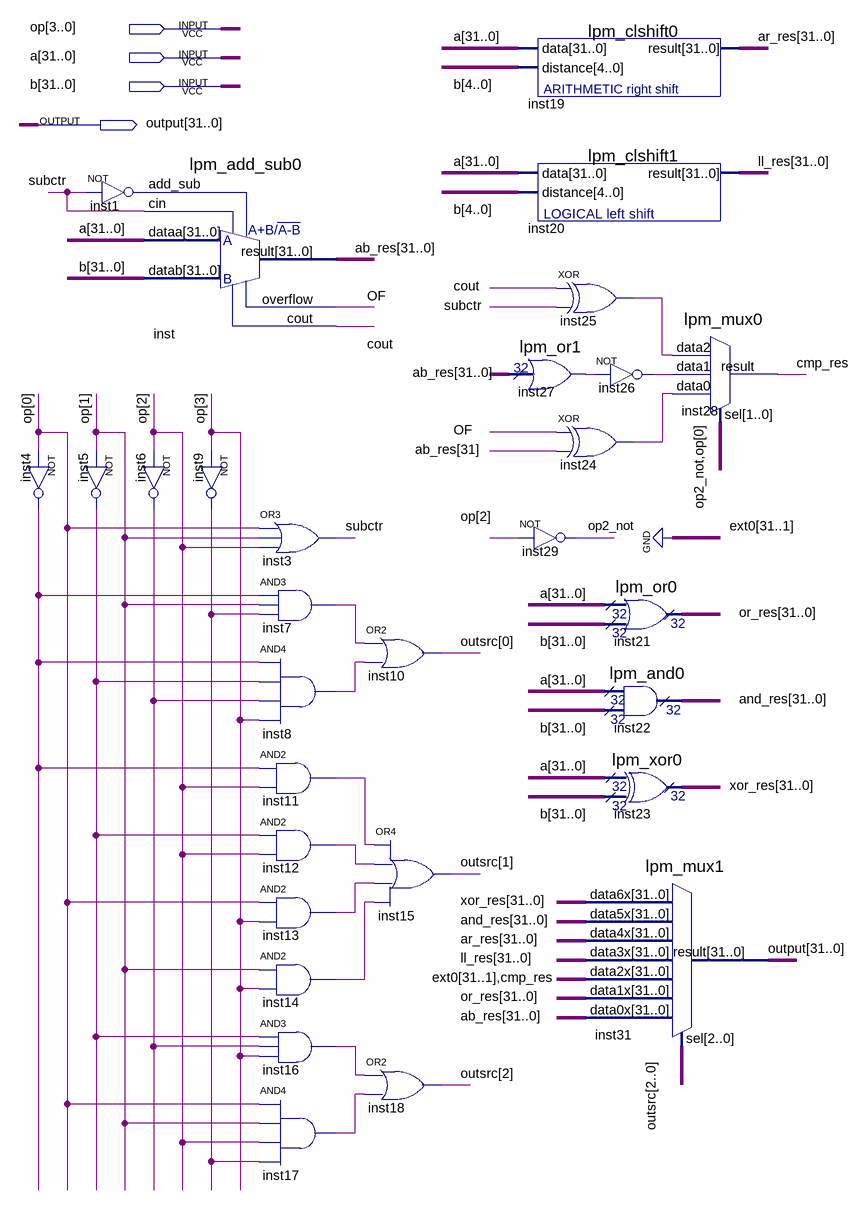
[diagram p0: schematic sheet]
// Quartus schematic ALU.bdf as structural Verilog: 30 symbols, 4 pins
module ALU (
  input  [3:0] op,
  input  [31:0] a,
  input  [31:0] b,
  output [31:0] \output 
);

  wire cmp_res, cout, inst1_out, inst4_out, inst5_out, inst6_out, inst7_out, inst8_out, inst9_out,
       inst11_out, inst12_out, inst13_out, inst14_out, inst16_out, inst17_out, inst24_out, inst25_out,
       inst26_out, inst27_result, OF, op2_not, subctr;
  wire [2:0] outsrc;
  wire [31:0] ab_res, and_res, ar_res, ll_res, or_res, xor_res;

  not inst4 (inst4_out, op[0]);
  not inst1 (inst1_out, subctr);
  not inst5 (inst5_out, op[1]);
  lpm_add_sub0 inst (
    .dataa(a), .datab(b), .add_sub(inst1_out), .cin(subctr), .result(ab_res), .overflow(OF), .cout(cout));
  not inst6 (inst6_out, op[2]);
  not inst9 (inst9_out, op[3]);
  or inst3 (subctr, op[0], op[1], op[2]);
  and inst7 (inst7_out, inst4_out, op[1], inst9_out);
  and inst8 (inst8_out, inst4_out, inst5_out, inst6_out, op[3]);
  and inst11 (inst11_out, inst4_out, op[2]);
  and inst12 (inst12_out, inst5_out, op[2]);
  and inst13 (inst13_out, op[0], op[3]);
  and inst14 (inst14_out, op[1], op[3]);
  and inst16 (inst16_out, inst5_out, inst6_out, op[3]);
  and inst17 (inst17_out, op[0], op[1], op[2], inst9_out);
  or inst10 (outsrc[0], inst7_out, inst8_out);
  or inst15 (outsrc[1], inst11_out, inst12_out, inst13_out, inst14_out);
  or inst18 (outsrc[2], inst16_out, inst17_out);
  lpm_clshift0 inst19 (.data(a), .distance(b[4:0]), .result(ar_res));
  lpm_clshift1 inst20 (.data(a), .distance(b[4:0]), .result(ll_res));
  xor inst25 (inst25_out, cout, subctr);
  lpm_or1 inst27 (.data(ab_res), .result(inst27_result));
  xor inst24 (inst24_out, OF, ab_res[31]);
  not inst29 (op2_not, op[2]);
  not inst26 (inst26_out, inst27_result);
  lpm_or0 inst21 (.data0x(a), .data1x(b), .result(or_res));
  lpm_and0 inst22 (.data0x(a), .data1x(b), .result(and_res));
  lpm_xor0 inst23 (.data0x(a), .data1x(b), .result(xor_res));
  lpm_mux1 inst31 (
    .data6x(xor_res), .data5x(and_res), .data4x(ar_res), .data3x(ll_res), .data2x({{31{1'b0}}, cmp_res}),
    .data1x(or_res), .data0x(ab_res), .sel(outsrc), .result(\output ));
  lpm_mux0 inst28 (
    .data2(inst25_out), .data1(inst26_out), .data0(inst24_out), .sel({op2_not, op[0]}), .result(cmp_res));
endmodule
